# Altium schematic sheet ethernet_PoE.SchDoc
size A4; SheetNumber: 3; SheetTotal: 5
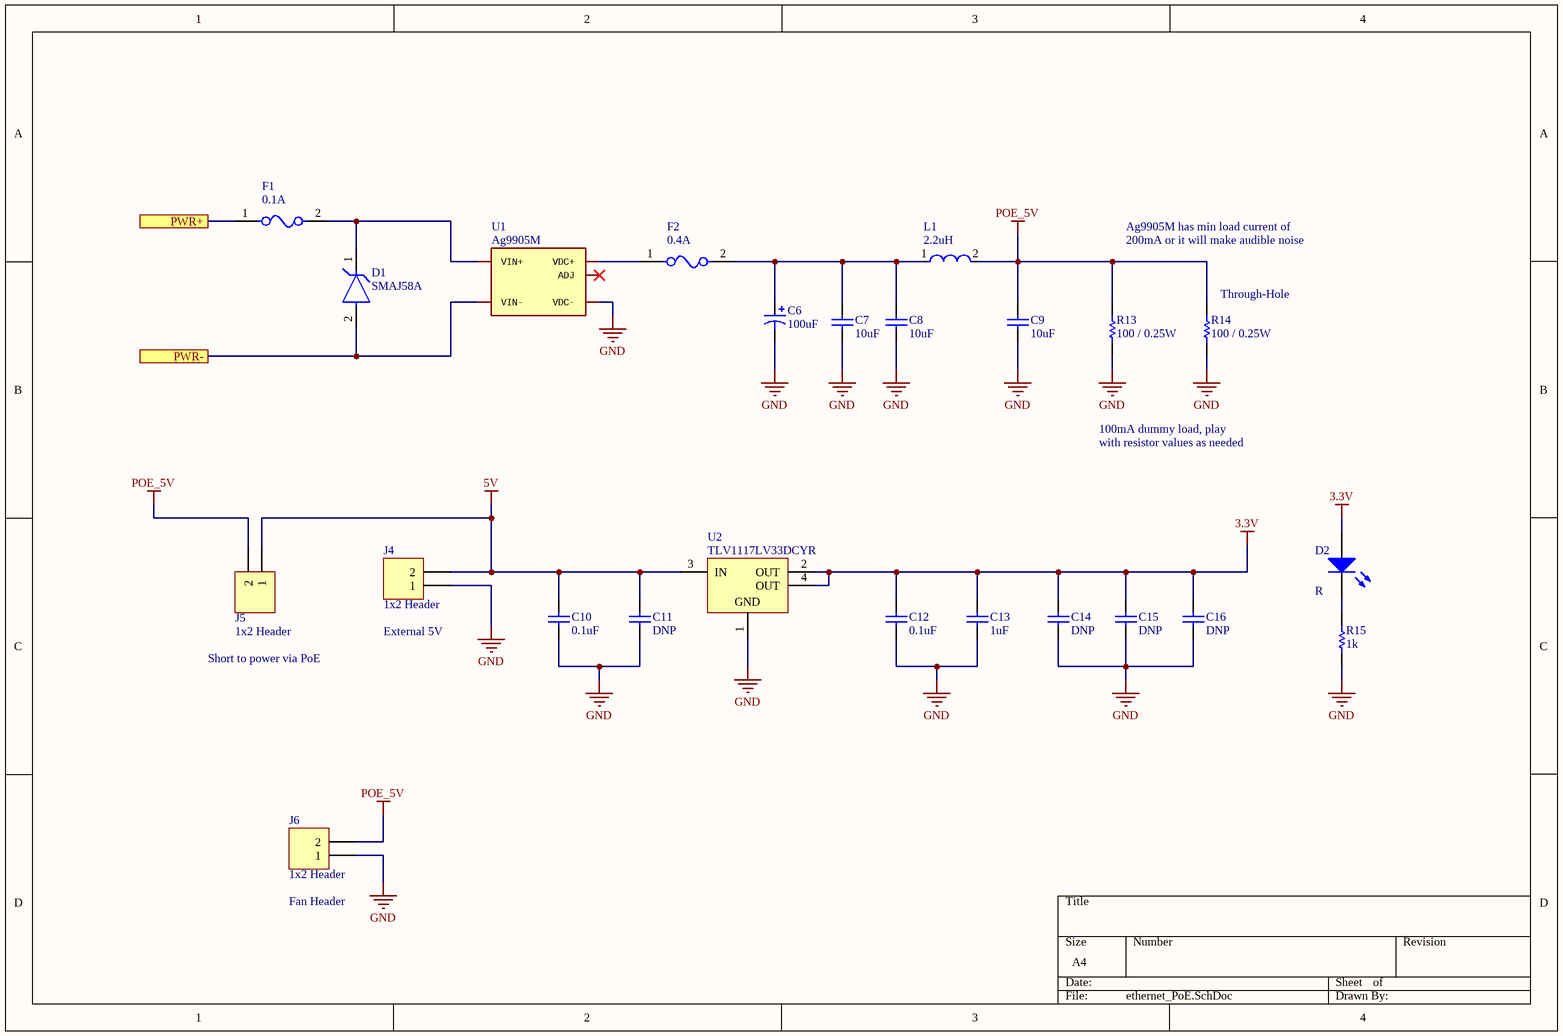
[diagram p0: ethernet_PoE.SchDoc]

## Parts
C6  value 100uF  [CAPPRD350W60D825H1300]  (hidden comment: Capacitor - Polarized)
C7  value 10uF  [0603 - Capacitor]  (hidden comment: Capacitor - Nonpolarized)
C8  value 10uF  [0603 - Capacitor]  (hidden comment: Capacitor - Nonpolarized)
C9  value 10uF  [0603 - Capacitor]  (hidden comment: Capacitor - Nonpolarized)
C10  value 0.1uF  [0603 - Capacitor]  (hidden comment: Capacitor - Nonpolarized)
C11  value DNP  [0603 - Capacitor]  (hidden comment: Capacitor - Nonpolarized)
C12  value 0.1uF  [0603 - Capacitor]  (hidden comment: Capacitor - Nonpolarized)
C13  value 1uF  [0603 - Capacitor]  (hidden comment: Capacitor - Nonpolarized)
C14  value DNP  [0603 - Capacitor]  (hidden comment: Capacitor - Nonpolarized)
C15  value DNP  [0603 - Capacitor]  (hidden comment: Capacitor - Nonpolarized)
C16  value DNP  [0603 - Capacitor]  (hidden comment: Capacitor - Nonpolarized)
D1  SMAJ58A  [FP-SMAJ-MFG]
D2  LED  [0805 LED]  (value not drawn)
F1  696101000002  [Wurth_0_MFG]  (value not drawn)
F2  696101000002  [Wurth_0_MFG]  (value not drawn)
J4  1x2 Header  [HDR1X2]
J5  1x2 Header  [HDR1X2]
J6  1x2 Header  [HDR1X2]
L1  2.2uH  [FP-DFE252010C-IPC_A]
R13  value 100 / 0.25W  [RESAD1100W55L680D260]  (hidden comment: Resistor)
R14  value 100 / 0.25W  [RESAD1100W55L680D260]  (hidden comment: Resistor)
R15  value 1k  [0603 - Resistor]  (hidden comment: Resistor)
U1  Ag9905M  [Ag9900m]
U2  TLV1117LV33DCYR  [DCY0004A_N]

## Ports
PWR+ (see main[1B]), PWR- (see main[1B])

## Nets
3.3V: C12.2 C13.2 C14.2 C15.2 C16.2 D2.1(A) U2.2(OUT) U2.4(OUT)
5V: C10.2 C11.2 J4.2 J5.1 U2.3(IN)
GND: C6.2 C7.1 C8.1 C9.1 C10.1 C11.1 C12.1 C13.1 C14.1 C15.1 C16.1 J4.1 J6.1 R13.1 R14.1 R15.1 U1.3(VDC-) U2.1(GND)
POE_5V: C9.2 J5.2 J6.2 L1.2 R13.2 R14.2
PWR+: F1.1 ; port PWR+
PWR-: D1.2(A) U1.7,8(VIN-) ; port PWR-
NetC6_1: C6.1 C7.2 C8.2 F2.2 L1.1
NetD1_1: D1.1(C) F1.2 U1.5,6(VIN+)
NetD2_2: D2.2(K) R15.2
NetF2_1: F2.1 U1.1,2(VDC+)

Not connected (* = marked no-connect by the designer): U1 4(ADJ)*

## Notes on the sheet
- (near F1) 0.1A
- (near F2) 0.4A
- Ag9905M has min load current of
- 200mA or it will make audible noise
- (near R14) Through-Hole
- 100mA dummy load, play
- with resistor values as needed
- (near J4) External 5V
- R
- Short to power via PoE
- (near J6) Fan Header

## Library data of the parts
C6 = Capacitor - Polarized: Polarized Capacitor; Manufacturer: Lelon; Manufacturer Part Number: RGA101M1HBK-0811G; Rating: 50V; Supplier: Mouser; Supplier Part Number: 140-RGA101M1HBK0811G; Link: https://www.mouser.ca/ProductDetail/Lelon/RGA101M1HBK-0811G?qs=pNDdEcSXiOBNivHdElCSJA%3D%3D
C7-C10 C12 = Capacitor - Nonpolarized: Nonpolarized Capacitor; Manufacturer: YAGEO; Manufacturer Part Number: CC0603KRX7R9BB104; Rating: 50V X7R +/-10%; Supplier Part Number: C14663; Supplier: JLCPCB; Link: https://jlcpcb.com/partdetail/Yageo-CC0603KRX7R9BB104/C14663
C11 C14-C16 = Capacitor - Nonpolarized: Nonpolarized Capacitor; Supplier Part Number: *; Supplier: *; Manufacturer: *; Rating: *; Manufacturer Part Number: *
C13 = Capacitor - Nonpolarized: Nonpolarized Capacitor; Manufacturer: Samsung Electro-Mechanics; Manufacturer Part Number: CL10A105KB8NNNC; Rating: 50V; Supplier Part Number: C15849; Supplier: JLCPCB; Link: https://jlcpcb.com/partdetail/16531-CL10A105KB8NNNC/C15849
D1 = CMP-08607-000100-1: TVS DIODE 58V 93.6V DO214AC; Manufacturer: Murata Electronics; Manufacturer Part Number: BLM21AG121SH1D; Link: https://www.mouser.ca/ProductDetail/Murata-Electronics/BLM21AG121SH1D?qs=RTwwdbUDBXC774LJBjqxGQ%3D%3D; Supplier: Mouser; Supplier Part Number: 81-BLM21AG121SH1D
D2 = LED: Light Emitting Diode; Manufacturer Part Number: NCD0805R1; Manufacturer: Foshan NationStar Optoelectronics; Value: *; Supplier Part Number: C84256; Rating: *; Supplier: JLCPCB; Link: https://jlcpcb.com/partdetail/85425-NCD0805R1/C84256
F1 F2 = 696101000002: Manufacturer: Wurth Elektronik; Link: https://www.mouser.ca/ProductDetail/Wurth-Elektronik/696101000002?qs=sGAEpiMZZMuxTAA0eeO5G4B6PR9Rh8ggTQiUs4G0%252BG%2FdkdTX7N7tpQ%3D%3D; Manufacturer Part Number: 696101000002; Supplier: Mouser; Supplier Part Number: 710-696101000002
J4-J6 = 1x2 Header: 1x2 Pin Header
L1 = CMP-06042-014626-1: Shielded Wirewound Inductor 2.2uH  1700mA 0.115Ω 1008 (2520); Manufacturer: Murata Electronics; Manufacturer Part Number: DFE252010P-2R2M=P2; Link: https://jlcpcb.com/parts/componentSearch?searchTxt=DFE252010P-2R2M%3DP2; Supplier: JLCPCB; Supplier Part Number: C882952
R15 = Resistor: Manufacturer Part Number: 0603WAF1001T5E; Manufacturer: UNI-ROYAL(Uniroyal Elec); Rating: 100mW; Supplier Part Number: C21190; Supplier: JLCPCB; Link: https://jlcpcb.com/partdetail/21904-0603WAF1001T5E/C21190
U1 = Ag99005M: pin to pad: 1,2>1+2 5,6>5+6 7,8>7+8; Manufacturer: Silvertel; Link: https://www.mouser.ca/ProductDetail/Silvertel/Ag9905M?qs=OlC7AqGiEDnwSueIfRW6OQ%3D%3D; Manufacturer Part Number: Ag9905M; Supplier: Mouser; Supplier Part Number: 480-AG9905M
U2 = CMP-0395-00503-2: Single Output LDO, 1 A, Fixed 3.3 V Output, 2 to 5.5 V Input, 4-pin SOT-223 (DCY), -40 to 125 degC, Green (RoHS & no Sb/Br); Manufacturer: Texas Instruments; Link: https://jlcpcb.com/partdetail/TexasInstruments-TLV1117LV33DCYR/C15578; Manufacturer Part Number: TLV1117LV33DCYR; Supplier: JLCPCB; Supplier Part Number: C15578